# EasyEDA Pro project GD32F470IIH6.epro, schematic Schematic1
Create Date: 2024-01-08; Page Name: P1; Project Name: GD32_SDRAM_RGB888_20240421; Schematic Name: Schematic1; Update Date: 2024-04-21; Company: 嘉立创EDA; Page Size: A3; Version: V1.0
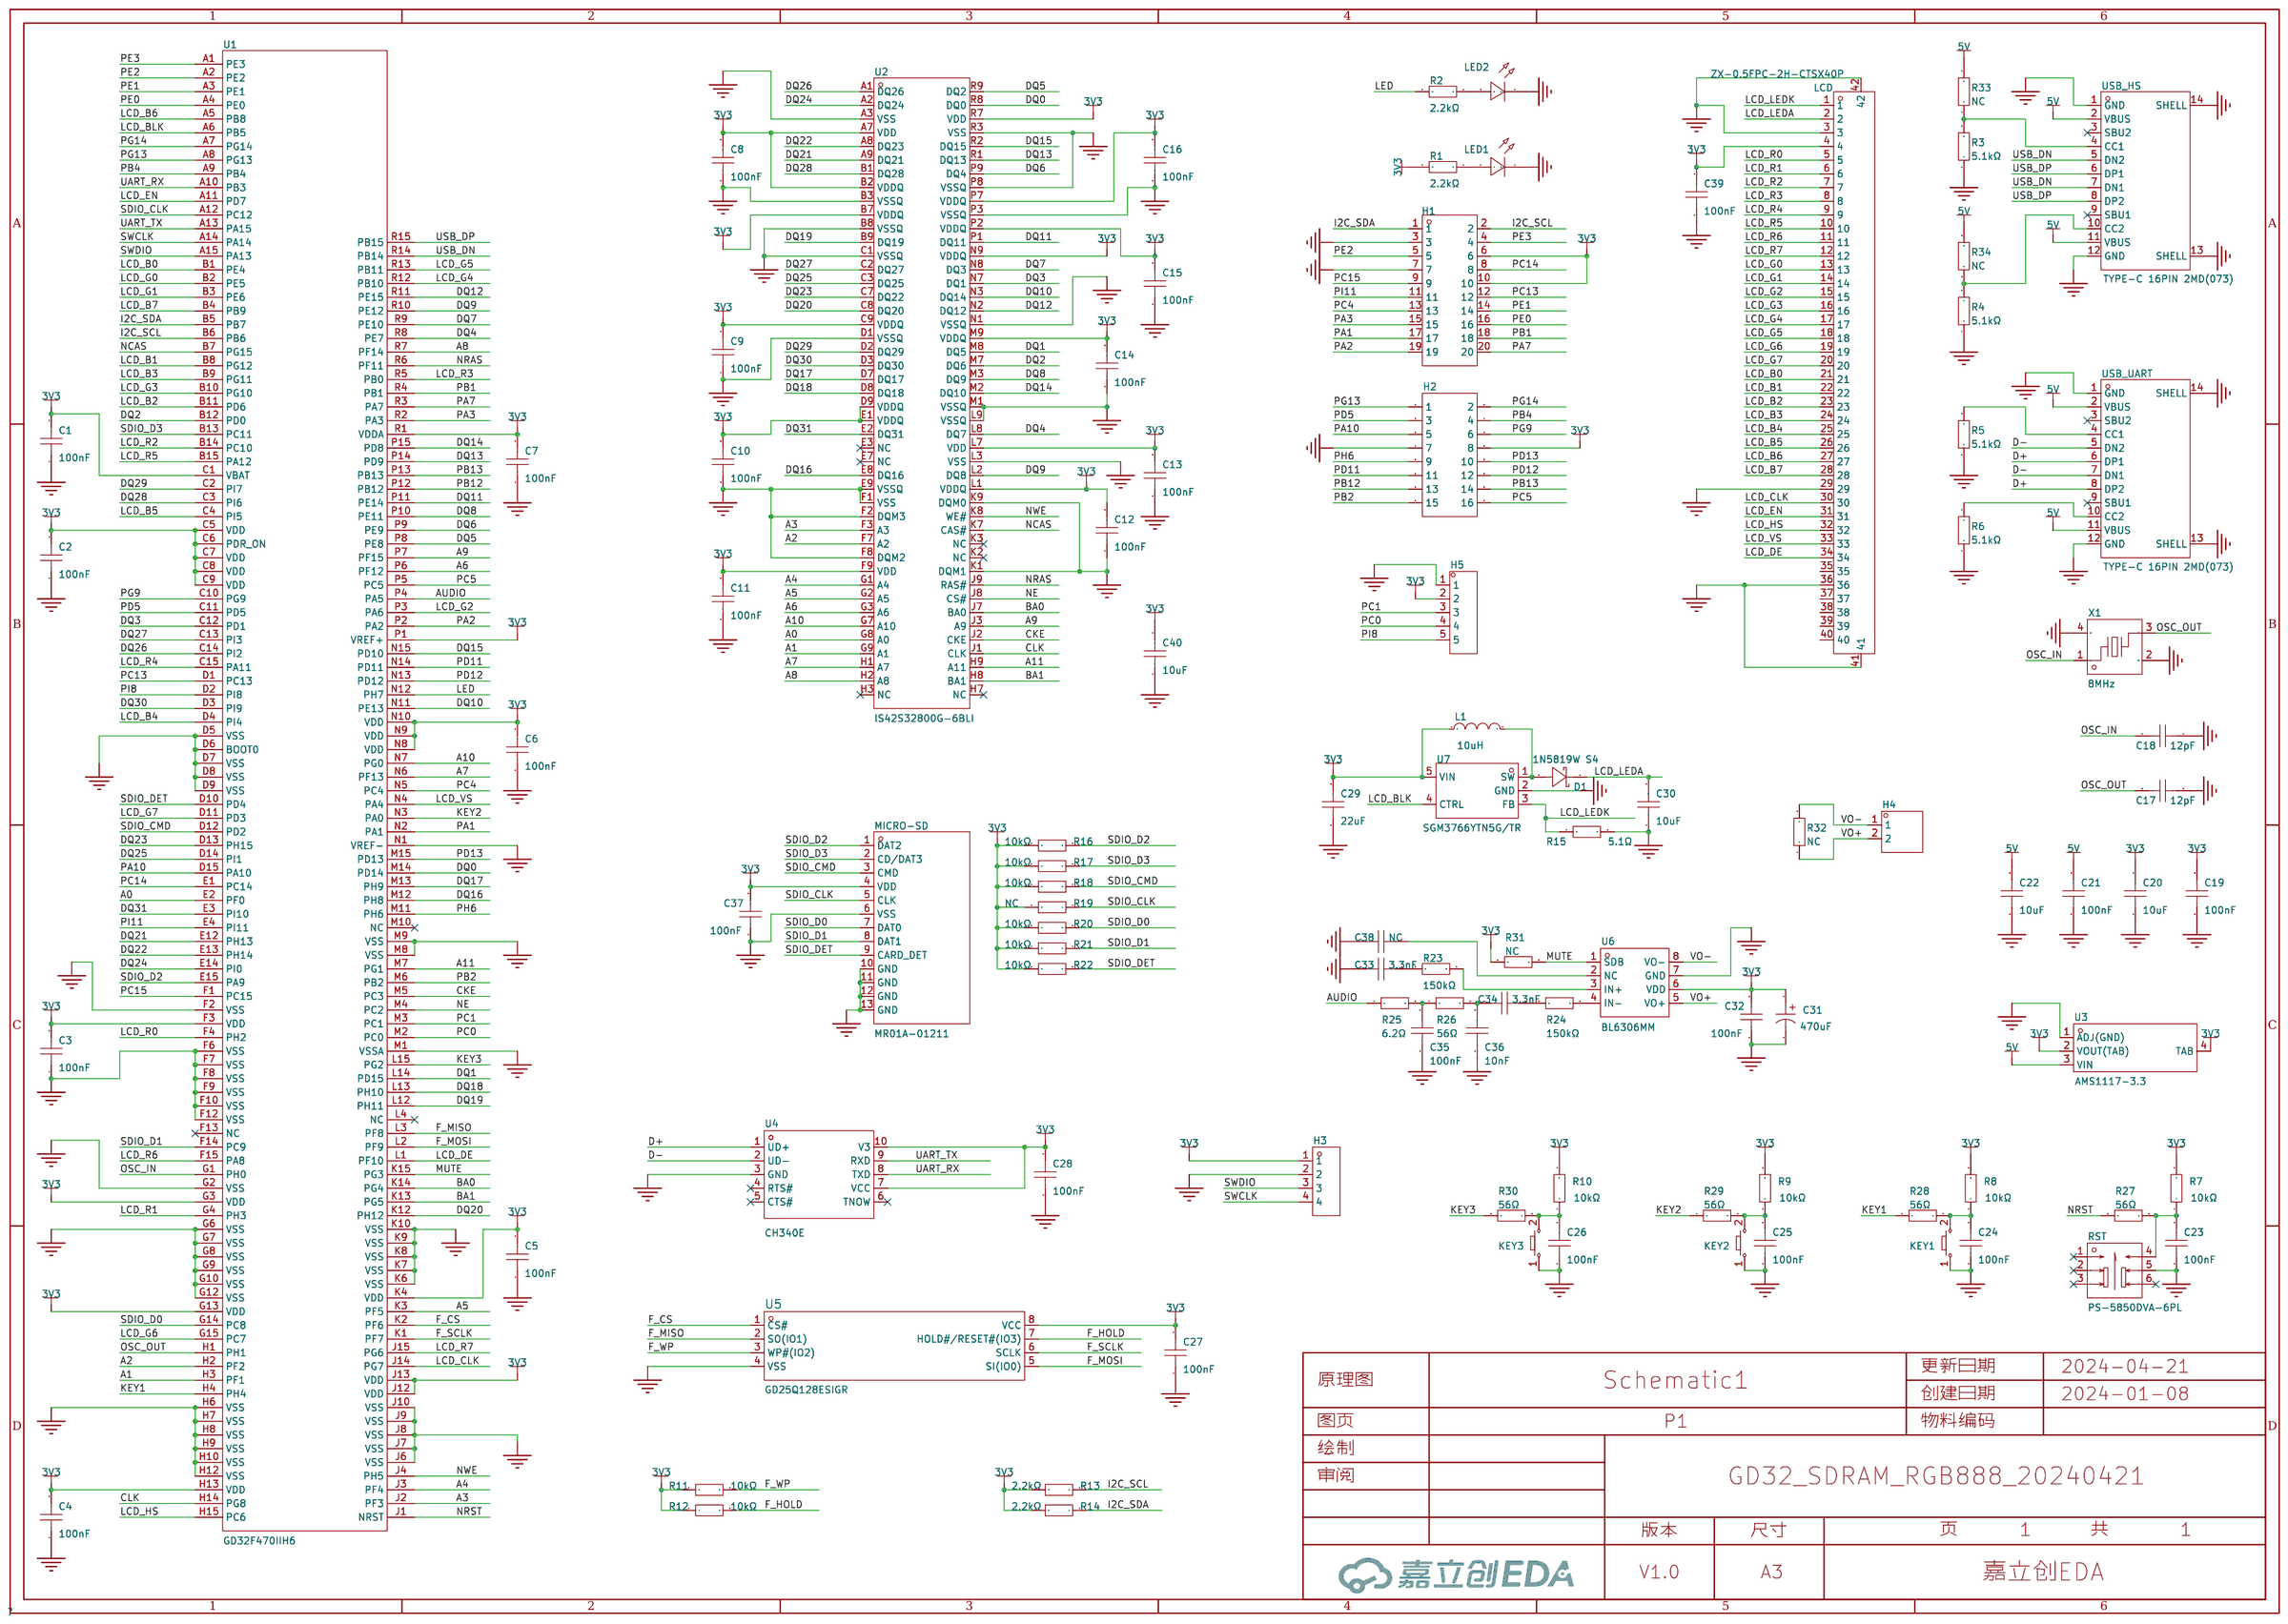
[diagram p0: schematic sheet]

## Parts
C1  100nF  [C0402]
C2  100nF  [C0402]
C3  100nF  [C0402]
C4  100nF  [C0402]
C5  100nF  [C0402]
C6  100nF  [C0402]
C7  100nF  [C0402]
C8  100nF  [C0402]
C9  100nF  [C0402]
C10  100nF  [C0402]
C11  100nF  [C0402]
C12  100nF  [C0402]
C13  100nF  [C0402]
C14  100nF  [C0402]
C15  100nF  [C0402]
C16  100nF  [C0402]
C17  12pF  [C0603]
C18  12pF  [C0603]
C19  100nF  [C0603]
C20  10uF  [C0805]
C21  100nF  [C0603]
C22  10uF  [C0805]
C23  100nF  [C0402]
C24  100nF  [C0402]
C25  100nF  [C0402]
C26  100nF  [C0402]
C27  100nF  [C0603]
C28  100nF  [C0603]
C29  22uF  [C0805]
C30  10uF  [C0805]
C31  470uF  [CAP-TH_BD6.3-P2.50-D0.5-FD]
C32  100nF  [C0603]
C33  3.3nF  [C0603]
C34  3.3nF  [C0603]
C35  100nF  [C0603]
C36  10nF  [C0603]
C37  100nF  [C0402]
C38  NC  [C0603]
C39  100nF  [C0402]
C40  10uF  [C0805]
D1  1N5819W S4  [SOD-123_L2.7-W1.6-LS3.7-FD]
H1  -  [HDR-TH_20P-P2.54-V-M-R2-C10-S2.54]
H2  -  [HDR-TH_16P-P2.54-V-M-R2-C8-S2.54]
H3  -  [HDR-TH_4P-P2.54-V-M]
H4  -  [HDR-TH_2P-P2.54-V-M-1]
H5  -  [HDR-TH_5P-P2.54-V-M]
KEY1  K2-1107ST-A4DW-06  [KEY-SMD_L6.2-W3.6-LS8.0]
KEY2  K2-1107ST-A4DW-06  [KEY-SMD_L6.2-W3.6-LS8.0]
KEY3  K2-1107ST-A4DW-06  [KEY-SMD_L6.2-W3.6-LS8.0]
L1  10uH  [IND-SMD_L4.0-W4.0]
LCD  ZX-0.5FPC-2H-CTSX40P  [FPC-SMD_40P-P0.50_ZX-0.5FPC-2H-CTSX40P]
LED1  XL-2012UGC  [LED0805-RD_GREEN]
LED2  XL-2012UGC  [LED0805-RD_GREEN]
MICRO-SD  MR01A-01211  [TF-SMD_MR01A-01211]
R1  2.2kΩ  [R0603]
R2  2.2kΩ  [R0603]
R3  5.1kΩ  [R0603]
R4  5.1kΩ  [R0603]
R5  5.1kΩ  [R0603]
R6  5.1kΩ  [R0603]
R7  10kΩ  [R0603]
R8  10kΩ  [R0603]
R9  10kΩ  [R0603]
R10  10kΩ  [R0603]
R11  10kΩ  [R0603]
R12  10kΩ  [R0603]
R13  2.2kΩ  [R0603]
R14  2.2kΩ  [R0603]
R15  5.1Ω  [R0603]
R16  10kΩ  [R0603]
R17  10kΩ  [R0603]
R18  10kΩ  [R0603]
R19  NC  [R0603]
R20  10kΩ  [R0603]
R21  10kΩ  [R0603]
R22  10kΩ  [R0603]
R23  150kΩ  [R0603]
R24  150kΩ  [R0603]
R25  6.2Ω  [R0603]
R26  56Ω  [R0603]
R27  56Ω  [R0603]
R28  56Ω  [R0603]
R29  56Ω  [R0603]
R30  56Ω  [R0603]
R31  NC  [R0603]
R32  NC  [R0603]
R33  NC  [R0603]
R34  NC  [R0603]
RST  PS-5850DVA-6PL  [SW-TH_6P-L5.8-W5.8-P2.00-LS4.5_PS-5850DVA-6PL]
U1  GD32F470IIH6  [BGA-201_L10.0-W10.0-P0.65-TL_GD32F450XXX]
U2  IS42S32800G-6BLI  [BGA-90_L13.0-W8.0-R6-C15-P0.80-TL]
U3  AMS1117-3.3  [SOT-223-4_L6.5-W3.5-P2.30-LS7.0-BR]
U4  CH340E  [MSOP-10_L3.0-W3.0-P0.50-LS5.0-BL]
U5  GD25Q128ESIGR  [SOP-8_L5.3-W5.3-P1.27-LS8.0-BL]
U6  BL6306MM  [MSOP-8_L3.0-W3.0-P0.65-LS4.9-BL]
U7  SGM3766YTN5G/TR  [TSOT-23-5_L2.9-W1.6-P0.95-LS2.8-BL]
USB_HS  TYPE-C 16PIN 2MD(073)  [USB-C-SMD_TYPE-C-6PIN-2MD-073]
USB_UART  TYPE-C 16PIN 2MD(073)  [USB-C-SMD_TYPE-C-6PIN-2MD-073]
X1  8MHz  [OSC-SMD_4P-L3.2-W2.5-BL]

## Library data of the parts
C1-C16 C23-C26 C37 C39 = CC0402KRX7R7BB104: 容值:100nF;精度:±10%;额定电压:16V;材质(温度系数):X7R;; LCSC Part Name: 100nF ±10% 16V; Supplier Part: C60474; Manufacturer: YAGEO(国巨); Supplier Footprint: 0402; JLCPCB Part Class: Extended Part; Datasheet: https://atta.szlcsc.com/upload/public/pdf/source/20211223/9278FD768280B81DDBEF48FA36411A03.pdf; Supplier: LCSC; Tolerance: ±10%; Voltage Rated: 16V; Temperature Coefficient: X7R; Check: true
C17 C18 = CL10C120JB8NNNC: 容值:12pF;精度:±5%;额定电压:50V;材质(温度系数):C0G;; LCSC Part Name: 12pF ±5% 50V; Supplier Part: C38523; Manufacturer: SAMSUNG(三星); Supplier Footprint: 0603; JLCPCB Part Class: Basic Part; Datasheet: https://atta.szlcsc.com/upload/public/pdf/source/20160218/1457707763339.pdf; Supplier: LCSC; Tolerance: ±5%; Voltage Rated: 50V; Temperature Coefficient: C0G; Check: true
C19 C21 C27 C28 C32 C35 = 0603B104K500NT: 容值:100nF;精度:±10%;额定电压:50V;材质(温度系数):X7R;; LCSC Part Name: 100nF ±10% 50V; Supplier Part: C30926; Manufacturer: FH(风华); Supplier Footprint: 0603; JLCPCB Part Class: Extended Part; Datasheet: https://atta.szlcsc.com/upload/public/pdf/source/20200305/C486355_26A10D38EF8C2A5C37091D0039909270.pdf; Supplier: LCSC; Tolerance: ±10%; Voltage Rated: 50V; Temperature Coefficient: X7R; Check: true
C20 C22 C30 C40 = CL21A106KAYNNNE_C15850: 容值:10uF;精度:±10%;额定电压:25V;材质(温度系数):X5R;; LCSC Part Name: 10uF ±10% 25V; Supplier Part: C15850; Manufacturer: SAMSUNG(三星); Manufacturer Part: CL21A106KAYNNNE; Supplier Footprint: 0805; JLCPCB Part Class: Basic Part; Datasheet: https://atta.szlcsc.com/upload/public/pdf/source/20160218/1457707763339.pdf; Supplier: LCSC; Tolerance: ±10%; Voltage Rated: 25V; Temperature Coefficient: X5R; Check: true
C29 = CL21A226MAQNNNE: 容值:22uF;精度:±20%;额定电压:25V;材质(温度系数):X5R;; LCSC Part Name: 22uF ±20% 25V; Supplier Part: C45783; Manufacturer: SAMSUNG(三星); Supplier Footprint: 0805; JLCPCB Part Class: Basic Part; Datasheet: https://atta.szlcsc.com/upload/public/pdf/source/20160218/1457707763339.pdf; Supplier: LCSC; Tolerance: ±20%; Voltage Rated: 25V; Temperature Coefficient: X5R; Check: true
C31 = GR1C471M0611: 容值:470uF;精度:±20%;额定电压:16V;纹波电流:-;等效串联电阻:-;; LCSC Part Name: 470uF ±20% 16V; Supplier Part: C2873966; Manufacturer: ROQANG(容强); Supplier Footprint: 插件,D6.3xL11mm; JLCPCB Part Class: 扩展库; Datasheet: https://atta.szlcsc.com/upload/public/pdf/source/20220308/D48251384B7F3C8BC717F16A50EC19EF.pdf; Supplier: LCSC; Tolerance: ±20%; Rated Voltage: 16V; φD: 6.3mm; L: 11mm; Check: true
C33 C34 = CL10B332KB8NNNC: 容值:3.3nF;精度:±10%;额定电压:50V;材质(温度系数):X7R;; LCSC Part Name: 3.3nF ±10% 50V; Supplier Part: C1613; Manufacturer: SAMSUNG(三星); Supplier Footprint: 0603; JLCPCB Part Class: Basic Part; Datasheet: https://atta.szlcsc.com/upload/public/pdf/source/20160218/1457707763339.pdf; Supplier: LCSC; Tolerance: ±10%; Voltage Rated: 50V; Temperature Coefficient: X7R; Check: true
C36 = 0603B103K500NT: 容值:10nF;精度:±10%;额定电压:50V;材质(温度系数):X7R;; LCSC Part Name: 10nF ±10% 50V; Supplier Part: C57112; Manufacturer: FH(风华); Supplier Footprint: 0603; JLCPCB Part Class: Basic Part; Datasheet: https://atta.szlcsc.com/upload/public/pdf/source/20200305/C486355_26A10D38EF8C2A5C37091D0039909270.pdf; Supplier: LCSC; Tolerance: ±10%; Voltage Rated: 50V; Temperature Coefficient: X7R; Check: true
C38 = CAP_0603: Supplier Footprint: 0603; Check: true
D1 = 1N5819W S4: 二极管配置:-;正向压降(Vf):600mV@200mA;直流反向耐压(Vr):40V;平均整流电流(Io):350mA;; LCSC Part Name: 电压:40V 电流:350mA; Supplier Part: C2939006; Manufacturer: KUU; Supplier Footprint: SOD-123; JLCPCB Part Class: 扩展库; Datasheet: https://atta.szlcsc.com/upload/public/pdf/source/20220104/054CAEE816AAE12211B33E667335376D.pdf; Supplier: LCSC; Forward Voltage (Vf@If): 600mV@200mA; Reverse Voltage (Vr): 40V; Average Rectified Current (Io): 350mA; Reverse Leakage Current (Ir): 5uA@30V; Check: true
H1 = HDR-M_2.54_2x10: Supplier Part: C30734; Supplier Footprint: 插件,P=2.54mm; Check: true
H2 = HDR-M_2.54_2x8: Supplier Part: C68234; Supplier Footprint: 插件,P=2.54mm; Check: true
H3 = HDR-M_2.54_1x4P: Supplier Part: C492403; Supplier Footprint: 插件; Check: true
H4 = HDR-M_2.54_1x2P: Supplier Part: C124375; Supplier Footprint: 插件; Check: true
H5 = HDR-M_2.54_1x5P: Supplier Part: C358687; Supplier Footprint: 插件
KEY1-KEY3 = K2-1107ST-A4DW-06: 电路结构:单刀单掷;按钮形状:矩形按钮;作用力:250gf;安装方式:立贴;开关长度:6.1mm;开关宽度:3.6mm;开关高度:2.5mm;触点电流:50mA;额定电压(DC):12V;绝缘电阻:100MΩ;带灯:-;机械寿命:10万次;; LCSC Part Name: 轻触开关 3.6*6.1*2.5; Supplier Part: C118141; Manufacturer: 韩国韩荣; Supplier Footprint: SMD; JLCPCB Part Class: Extended Part; Datasheet: https://atta.szlcsc.com/upload/public/pdf/source/20210810/381712CEF248770C072B585C3485C888.pdf; Supplier: LCSC; Circuit: 单刀单掷; Actuator Style: 矩形按钮; Operating Force: 250gf; Mounting Style: 立贴; Switch Length: 6.1mm; Switch Width: 3.6mm; Switch Height: 2.5mm; Contact Current: 50mA; Voltage Rating (DC): 12V; Insulation Resistance: 100MΩ; Mechanical Life: 10万次; Operating Temperature: -25℃~+85℃; Check: true
L1 = FHD4020S-100MT: 电感值:10uH;精度:±20%;额定电流:2.35A;饱和电流(Isat):3.5A;; LCSC Part Name: 10uH ±20% 3.5A; Supplier Part: C602032; Manufacturer: cjiang(长江微电); Supplier Footprint: SMD,4x4mm; JLCPCB Part Class: 扩展库; Datasheet: https://atta.szlcsc.com/upload/public/pdf/source/20200609/C601990_BCEA243EC4DA0A9A288AA78A6DFB48A5.pdf; Supplier: LCSC; Tolerance: ±20%; Rated Current: 2.35A; Saturation Current (Isat): 3.5A; DC Resistance (DCR): 190mΩ
LCD = ZX-0.5FPC-2H-CTSX40P: 锁定特性:抽屉式;触点类型:上接;触点数量:40P;间距:0.5mm;安装类型:卧贴;工作温度范围:-25℃~+85℃;焊接温度(最大值):260℃;; LCSC Part Name: 间距:0.5mm P数:40P 抽屉式 上接; Supplier Part: C19191165; Manufacturer: Megastar(兆星); Supplier Footprint: SMD,P=0.5mm,卧贴; Datasheet: https://atta.szlcsc.com/upload/public/pdf/source/20231122/E6131C7FE9DD3C65191621EC56048569.pdf; Supplier: LCSC; Locking Feature: 抽屉式; Contact Type: 上接; Number of Contacts: 40P; Pitch: 0.5mm; Mounting Type: 卧贴; FFC, FCB Thickness: 0.3mm; Height Above Board: 2mm; Contact Material: 铜合金; Contact Plating: 锡; Operating Temperature Range: -25℃~+85℃; Soldering Temperature(Max): 260℃
LED1 LED2 = XL-2012UGC: 发光颜色:翠绿色;功率:80mW;正向电流:25mA;主波长:516nm~525nm;透镜颜色:无色透明透镜;色温:-;发光角度:120°;载带方式:正贴;工作温度:-30℃~+85℃;; Supplier Part: C965815; Manufacturer: XINGLIGHT(成兴光); Supplier Footprint: 0805; JLCPCB Part Class: Extended Part; Datasheet: https://atta.szlcsc.com/upload/public/pdf/source/20221102/ACA6CBC413A1A8AF38BEBA54306464BE.pdf; Supplier: LCSC; Emitted Color: 翠绿色; Power Dissipation: 80mW; Forward Current: 25mA; Dominant Wavelength: 516nm~525nm; Peak Wavelength: 534nm; Lens Color: 无色透明透镜; Viewing Angle: 120°; Mounting Sytle: 正贴; Operating Temperature: -30℃~+85℃; Forward Voltage (VF): 2.5V~3.6V; Luminous Intensity: 180mcd~400mcd; Check: true
MICRO-SD = MR01A-01211: 卡类型:MicroSD卡(TF卡);连接器类型:卡座;卡连接方式:自弹式;本体最大高度:1.85mm;工作温度范围:-25℃~+85℃;; Supplier Part: C479742; Manufacturer: ATOM(爱特姆); Supplier Footprint: SMD; JLCPCB Part Class: 扩展库; Datasheet: https://atta.szlcsc.com/upload/public/pdf/source/20200107/C479742_0284EDD146B0D8F7A9D47B481AEA01A2.pdf; Supplier: LCSC; Card Type: MicroSD卡(TF卡); Connector Type: 卡座; Card Connection Mode: 自弹式; Maximum Body Height: 1.85mm; Operating Temperature Range: -25℃~+85℃; Check: true
R1 R2 R13 R14 = 0603WAF2201T5E: 电阻类型:厚膜电阻;阻值:2.2kΩ;精度:±1%;功率:100mW;最大工作电压:75V;温度系数:±100ppm/℃;; LCSC Part Name: 2.2kΩ ±1% 100mW 厚膜电阻; Supplier Part: C4190; Manufacturer: UNI-ROYAL(厚声); Supplier Footprint: 0603; JLCPCB Part Class: Basic Part; Datasheet: https://atta.szlcsc.com/upload/public/pdf/source/20200306/C422600_1E6D84923E4A46A82E41ADD87F860B5C.pdf; Supplier: LCSC; Type: 厚膜电阻; Tolerance: ±1%; Power(Watts): 100mW; Overload Voltage (Max): 75V; Temperature Coefficient: ±100ppm/℃; Operating Temperature Range: -55℃~+155℃; Check: true
R3-R6 R33 R34 = 0603WAF5101T5E: 电阻类型:厚膜电阻;阻值:5.1kΩ;精度:±1%;功率:100mW;最大工作电压:75V;温度系数:±100ppm/℃;; LCSC Part Name: 5.1kΩ ±1% 100mW 厚膜电阻; Supplier Part: C23186; Manufacturer: UNI-ROYAL(厚声); Supplier Footprint: 0603; JLCPCB Part Class: Basic Part; Datasheet: https://atta.szlcsc.com/upload/public/pdf/source/20200306/C422600_1E6D84923E4A46A82E41ADD87F860B5C.pdf; Supplier: LCSC; Type: 厚膜电阻; Tolerance: ±1%; Power(Watts): 100mW; Overload Voltage (Max): 75V; Temperature Coefficient: ±100ppm/℃; Operating Temperature Range: -55℃~+155℃; Check: true
R7-R12 R16-R22 R31 = 0603WAF1002T5E: 电阻类型:厚膜电阻;阻值:10kΩ;精度:±1%;功率:100mW;最大工作电压:75V;温度系数:±100ppm/℃;; LCSC Part Name: 厚膜电阻 10kΩ ±1% 100mW; Supplier Part: C25804; Manufacturer: UNI-ROYAL(厚声); Supplier Footprint: 0603; JLCPCB Part Class: Basic Part; Datasheet: https://atta.szlcsc.com/upload/public/pdf/source/20200306/C422600_1E6D84923E4A46A82E41ADD87F860B5C.pdf; Supplier: LCSC; Type: 厚膜电阻; Tolerance: ±1%; Power(Watts): 100mW; Overload Voltage (Max): 75V; Temperature Coefficient: ±100ppm/℃; Operating Temperature Range: -55℃~+155℃; Check: true
R15 = 0603WAJ051JT5E: 电阻类型:厚膜电阻;阻值:5.1Ω;精度:±5%;功率:100mW;最大工作电压:75V;温度系数:±400ppm/℃;; LCSC Part Name: 5.1Ω ±5% 100mW 厚膜电阻; Supplier Part: C25249; Manufacturer: UNI-ROYAL(厚声); Supplier Footprint: 0603; JLCPCB Part Class: 扩展库; Datasheet: https://atta.szlcsc.com/upload/public/pdf/source/20200306/C422600_1E6D84923E4A46A82E41ADD87F860B5C.pdf; Supplier: LCSC; Type: 厚膜电阻; Tolerance: ±5%; Power(Watts): 100mW; Overload Voltage (Max): 75V; Temperature Coefficient: ±400ppm/℃; Operating Temperature Range: -55℃~+155℃
R23 R24 = 0603WAF1503T5E: 电阻类型:厚膜电阻;阻值:150kΩ;精度:±1%;功率:100mW;最大工作电压:75V;温度系数:±100ppm/℃;; LCSC Part Name: 150kΩ ±1% 100mW 厚膜电阻; Supplier Part: C22807; Manufacturer: UNI-ROYAL(厚声); Supplier Footprint: 0603; JLCPCB Part Class: Basic Part; Datasheet: https://atta.szlcsc.com/upload/public/pdf/source/20200306/C422600_1E6D84923E4A46A82E41ADD87F860B5C.pdf; Supplier: LCSC; Type: 厚膜电阻; Tolerance: ±1%; Power(Watts): 100mW; Overload Voltage (Max): 75V; Temperature Coefficient: ±100ppm/℃; Operating Temperature Range: -55℃~+155℃; Check: true
R25 R32 = 0603WAJ062JT5E: 阻值:6.2Ω;精度:±5%;功率:100mW;温度系数:±200ppm/℃;电阻类型:厚膜电阻;; LCSC Part Name: 6.2Ω ±5% 100mW 厚膜电阻; Supplier Part: C25255; Manufacturer: UNI-ROYAL(厚声); Supplier Footprint: 0603; JLCPCB Part Class: 扩展库; Datasheet: https://atta.szlcsc.com/upload/public/pdf/source/20200306/C422600_1E6D84923E4A46A82E41ADD87F860B5C.pdf; Supplier: LCSC; Tolerance: ±5%; Power(Watts): 100mW; Overload Voltage (Max): 75V; Temperature Coefficient: ±200ppm/℃; Type: 厚膜电阻; Operating Temperature Range: -55℃~+155℃; Check: true
R26-R30 = 0603WAF560JT5E: 电阻类型:厚膜电阻;阻值:56Ω;精度:±1%;功率:100mW;最大工作电压:75V;温度系数:±200ppm/℃;; LCSC Part Name: 56Ω ±1% 100mW 厚膜电阻; Supplier Part: C25196; Manufacturer: UNI-ROYAL(厚声); Supplier Footprint: 0603; JLCPCB Part Class: 扩展库; Datasheet: https://atta.szlcsc.com/upload/public/pdf/source/20200306/C422600_1E6D84923E4A46A82E41ADD87F860B5C.pdf; Supplier: LCSC; Type: 厚膜电阻; Tolerance: ±1%; Power(Watts): 100mW; Overload Voltage (Max): 75V; Temperature Coefficient: ±200ppm/℃; Operating Temperature Range: -55℃~+155℃; Check: true
RST = PS-5850DVA-6PL: LCSC Part Name: 5.85.8六脚插板按键开关 自锁 160gf 3万寿命; Supplier Part: C5362621; Manufacturer: G-Switch(品赞); Datasheet: https://atta.szlcsc.com/upload/public/pdf/source/20230301/33AFE68FFBCC8FFE949B966EE62B2D52.pdf; Supplier: LCSC; Check: true
U1 = GD32F450IKH6: CPU内核:CM4;程序存储容量:512KB;RAM总容量:256KB;GPIO端口数量:140;工作电压范围:2.6V~3.6V;CPU最大主频:200MHz;程序存储器类型:FLASH;; Supplier Part: C2835082; Manufacturer: GigaDevice(兆易创新); Supplier Footprint: BGA-176; JLCPCB Part Class: 扩展库; Datasheet: https://atta.szlcsc.com/upload/public/pdf/source/20210608/C2835082_1B0108F20CB7F4615A6A76D6F1814B58.pdf; Supplier: LCSC; CPU Core: CM4; Program Storage Size: 512KB; RAM Size: 256KB; GPIO Ports Number: 140; Operating Voltage Range: 2.6V~3.6V; CPU Maximum Speed: 200MHz; Program Memory Type: FLASH; Operating Temperature Range: -40℃~+85℃; ADC (Bit): 12bit; DAC (Bit): 12bit; PWM (Bit): 16bit; 16Bit Timer: 10; 32Bit Timer: 2; CAN: 2; UART/USART: 8; I2C: 3; SPI: 5; Universal Serial Bus: 有; Peripheral/Function: 片载温度传感器；DMA；看门狗；LIN总线协议；PWM；LCD/LED驱动；以太网协议栈；IrDA；SDIO；RTC实时时钟; communication protocol: 以太网协议; Watchdog: 有; Real-Time Clock: 有; Infrared Data Association: 有; Secure Digital Input and Output: 有; Direct Memory Access: 有; Internal Oscillator: 有; Check: true
U2 = IS42S32800J-7BL: 存储器类型:-;存储器容量:-;存储器接口类型:-;工作电压:-;; LCSC Part Name: IS42S32800J 7BL; Supplier Part: C1349284; Manufacturer: ISSI(美国芯成); Supplier Footprint: TFBGA-90(8x13); JLCPCB Part Class: 扩展库; Datasheet: https://atta.szlcsc.com/upload/public/pdf/source/20210202/C1349284_CA3CEC5602E4679D049D183769B21E3F.pdf; Supplier: LCSC; Check: true
U3 = AMS1117-3.3_C347222: 输出类型:固定;最大输入电压:18V;输出电压:3.3V;输出电流:1A;电源纹波抑制比(PSRR):60dB@(120Hz);输出极性:正;; LCSC Part Name: 输入18V 输出3.3V 1A; Supplier Part: C347222; Manufacturer: UMW(友台半导体); Supplier Footprint: SOT-223; JLCPCB Part Class: 扩展库; Datasheet: https://atta.szlcsc.com/upload/public/pdf/source/20231109/155D79A26D9DB04352555A58D5969DC8.pdf; Supplier: LCSC; Output Type: 固定; Maximum Input Voltage: 18V; Output Voltage: 3.3V; Output Current: 1A; Power Supply Rejection Ratio (PSRR): 60dB@(120Hz); Dropout Voltage: 1.3V@(1A); Output Polarity: 正; Number of Outputs: 1; Check: true
U4 = CH340E: 应用功能:收发器;接口协议:USB 2.0;数据速率:2Mbps;; LCSC Part Name: USB转串口芯片 CH340; Supplier Part: C99652; Manufacturer: WCH(南京沁恒); Supplier Footprint: MSOP-10; JLCPCB Part Class: 扩展库; Datasheet: https://atta.szlcsc.com/upload/public/pdf/source/20230530/6E401E9554E9F5311886CC8B3F89B62E.pdf; Supplier: LCSC; Applications Function: 收发器; Protocol: USB 2.0; Data Rate: 2Mbps; Supply Voltage: 3.3V；5V; Check: true
U5 = GD25Q128ESIGR: 接口类型:SPI;存储容量:128Mbit;时钟频率(fc):133MHz;; Supplier Part: C2928891; Manufacturer: GigaDevice(兆易创新); Supplier Footprint: SOP-8-208mil; JLCPCB Part Class: 扩展库; Datasheet: https://atta.szlcsc.com/upload/public/pdf/source/20210423/C2758105_5B8FF46BBA9FF880A5F3E50B6815040C.pdf; Supplier: LCSC; Interface Type: SPI; Memory Size: 128Mbit; Clock Frequency (fc): 133MHz; Supply Voltage: 2.7V~3.6V; Operating Temperature: -40℃~+85℃; Check: true
U6 = BL6306MM: 功放类型:-;输出功率:-;; Supplier Part: C692272; Manufacturer: BL(上海贝岭); Supplier Footprint: MSOP-8; JLCPCB Part Class: 扩展库; Datasheet: https://atta.szlcsc.com/upload/public/pdf/source/20200628/C692272_F018E47F8449AF4A691BD8FD56389EFF.pdf; Supplier: LCSC; Check: true
U7 = SGM3766YTN5G/TR: Supplier Part: C5153481; Manufacturer: SGMICRO(圣邦微); Supplier Footprint: TSOT-23-5; JLCPCB Part Class: 扩展库; Datasheet: https://atta.szlcsc.com/upload/public/pdf/source/20221012/442720F1A2DB2C689412A6BDE8CAE1E9.pdf; Supplier: LCSC; Check: true
USB_HS USB_UART = TYPE-C 16PIN 2MD(073): 连接器类型:Type-C;标准:-;公母:母;端口数量:1;触点数量:16P;安装方式:卧贴;额定电流 - 电源:5A;工作温度范围:-25℃~+85℃;; LCSC Part Name: Type-C 母 卧贴 带定位柱 不锈钢外壳 2次模顶; Supplier Part: C2765186; Manufacturer: SHOU HAN(首韩); Supplier Footprint: SMD; JLCPCB Part Class: 扩展库; Datasheet: https://atta.szlcsc.com/upload/public/pdf/source/20211123/39B17C16241EAC15C5E277BDA434118E.pdf; Supplier: LCSC; Connector Type: Type-C; Gender: 母; Number of Ports: 1; Number of Contacts: 16P; Mounting Style: 卧贴; Current Rating - Power (Max): 5A; Operating Temperature Range: -25℃~+85℃; Check: true
X1 = X32258MOB4SI: 晶振类型:贴片晶振;频率:8MHz;常温频差:±10ppm;外接负载电容:12pF;频率稳定度(全温):±30ppm;; LCSC Part Name: 8MHz ±10ppm 12pF; Supplier Part: C2682775; Manufacturer: YXC(扬兴晶振); Supplier Footprint: SMD3225-4P; JLCPCB Part Class: 扩展库; Datasheet: https://atta.szlcsc.com/upload/public/pdf/source/20210106/C2682774_0CD4FDA5D9DA3FBEEC23BD607A48E4B0.pdf; Supplier: LCSC; Crystal Type: 贴片晶振; Normal temperature Frequency Tolerance: ±10ppm; External load capacitor: 12pF; Frequency Stability(Full temperature range): ±30ppm; Equivalent Series Resistance (ESR): 150Ω; Operating Temperature: -40℃~+85℃; Check: true

## Nets
3V3: C1.2 C2.2 C3.2 C4.2 C5.2 C6.2 C7.2 C8.2 C9.2 C10.2 C11.2 C12.2 C13.2 C14.2 C15.2 C16.2 C19.2 C20.2 C27.2 C28.2 C29.2 C31.1 C32.2 C37.2 C39.2 C40.2 H1.6 H1.10 H2.8 H3.1 H5.2 L1.1 LCD.4 MICRO-SD.4(VDD) R1.2 R7.2 R8.2 R9.2 R10.2 R11.1 R12.1 R13.2 R14.2 R16.2 R17.2 R18.2 R19.2 R20.2 R21.2 R22.2 R31.1 U1.C1(VBAT) U1.C5(VDD) U1.C6(PDR_ON) U1.C7(VDD) U1.C8(VDD) U1.C9(VDD) U1.F3(VDD) U1.G3(VDD) U1.G13(VDD) U1.H13(VDD) U1.J12(VDD) U1.J13(VDD) U1.K4(VDD) U1.N8(VDD) U1.N9(VDD) U1.N10(VDD) U1.P1(VREF+) U1.R1(VDDA) U2.A7(VDD) U2.B2(VDDQ) U2.B7(VDDQ) U2.C9(VDDQ) U2.D9(VDDQ) U2.E1(VDDQ) U2.F9(VDD) U2.L1(VDDQ) U2.L7(VDD) U2.M9(VDDQ) U2.N9(VDDQ) U2.P2(VDDQ) U2.P7(VDDQ) U2.R7(VDD) U3.2(VOUT(TAB)) U3.4(TAB) U4.7(VCC) U4.10(V3) U5.8(VCC) U6.6(VDD) U7.5(VIN)
5V: C21.2 C22.2 R33.2 R34.2 U3.3(VIN) USB_HS.2(VBUS) USB_HS.11(VBUS) USB_UART.2(VBUS) USB_UART.11(VBUS)
GND: C1.1 C2.1 C3.1 C4.1 C5.1 C6.1 C7.1 C8.1 C9.1 C10.1 C11.1 C12.1 C13.1 C14.1 C15.1 C16.1 C17.2 C18.2 C19.1 C20.1 C21.1 C22.1 C23.1 C24.1 C25.1 C26.1 C27.1 C28.1 C29.1 C30.1 C31.2 C32.1 C33.1 C35.1 C36.1 C37.1 C38.2 C39.1 C40.1 H1.3 H1.7 H2.7 H3.2 H5.1 KEY1.1 KEY2.1 KEY3.1 LCD.3 LCD.29 LCD.36 LCD.41 LCD.42 LED1.1(C) LED2.1(C) MICRO-SD.6(VSS) MICRO-SD.10(GND) MICRO-SD.11(GND) MICRO-SD.12(GND) MICRO-SD.13(GND) R3.1 R4.1 R5.1 R6.1 R15.2 RST.5 U1.D5(VSS) U1.D6(BOOT0) U1.D7(VSS) U1.D8(VSS) U1.D9(VSS) U1.F2(VSS) U1.F6(VSS) U1.F7(VSS) U1.F8(VSS) U1.F9(VSS) U1.F10(VSS) U1.F12(VSS) U1.G2(VSS) U1.G6(VSS) U1.G7(VSS) U1.G8(VSS) U1.G9(VSS) U1.G10(VSS) U1.G12(VSS) U1.H6(VSS) U1.H7(VSS) U1.H8(VSS) U1.H9(VSS) U1.H10(VSS) U1.H12(VSS) U1.J6(VSS) U1.J7(VSS) U1.J8(VSS) U1.J9(VSS) U1.J10(VSS) U1.K6(VSS) U1.K7(VSS) U1.K8(VSS) U1.K9(VSS) U1.K10(VSS) U1.M1(VSSA) U1.M8(VSS) U1.M9(VSS) U1.N1(VREF-) U2.A3(VSS) U2.B3(VSSQ) U2.B8(VSSQ) U2.C1(VSSQ) U2.D1(VSSQ) U2.E9(VSSQ) U2.F1(VSS) U2.F2(DQM3) U2.F8(DQM2) U2.K1(DQM1) U2.K9(DQM0) U2.L3(VSS) U2.L9(VSSQ) U2.M1(VSSQ) U2.N1(VSSQ) U2.P3(VSSQ) U2.P8(VSSQ) U2.R3(VSS) U3.1(ADJ(GND)) U4.3(GND) U5.4(VSS) U6.7(GND) U7.2(GND) USB_HS.1(GND) USB_HS.12(GND) USB_HS.13(SHELL) USB_HS.14(SHELL) USB_UART.1(GND) USB_UART.12(GND) USB_UART.13(SHELL) USB_UART.14(SHELL) X1.2(GND) X1.4(GND)
A0: U1.E2(PF0) U2.G8(A0)
A1: U1.H3(PF1) U2.G9(A1)
A2: U1.H2(PF2) U2.F7(A2)
A3: U1.J2(PF3) U2.F3(A3)
A4: U1.J3(PF4) U2.G1(A4)
A5: U1.K3(PF5) U2.G2(A5)
A6: U1.P6(PF12) U2.G3(A6)
A7: U1.N6(PF13) U2.H1(A7)
A8: U1.R7(PF14) U2.H2(A8)
A9: U1.P7(PF15) U2.J3(A9)
A10: U1.N7(PG0) U2.G7(A10)
A11: U1.M7(PG1) U2.H9(A11)
AUDIO: R25.1 U1.P4(PA5)
BA0: U1.K14(PG4) U2.J7(BA0)
BA1: U1.K13(PG5) U2.H8(BA1)
CKE: U1.M5(PC3) U2.J2(CKE)
CLK: U1.H14(PG8) U2.J1(CLK)
D+: U4.1(UD+) USB_UART.6(DP1) USB_UART.8(DP2)
D-: U4.2(UD-) USB_UART.5(DN2) USB_UART.7(DN1)
DQ0: U1.M14(PD14) U2.R8(DQ0)
DQ1: U1.L14(PD15) U2.M8(DQ5)
DQ2: U1.B12(PD0) U2.M7(DQ6)
DQ3: U1.C12(PD1) U2.N7(DQ1)
DQ4: U1.R8(PE7) U2.L8(DQ7)
DQ5: U1.P8(PE8) U2.R9(DQ2)
DQ6: U1.P9(PE9) U2.P9(DQ4)
DQ7: U1.R9(PE10) U2.N8(DQ3)
DQ8: U1.P10(PE11) U2.M3(DQ9)
DQ9: U1.R10(PE12) U2.L2(DQ8)
DQ10: U1.N11(PE13) U2.N3(DQ14)
DQ11: U1.P11(PE14) U2.P1(DQ11)
DQ12: U1.R11(PE15) U2.N2(DQ12)
DQ13: U1.P14(PD9) U2.R1(DQ13)
DQ14: U1.P15(PD8) U2.M2(DQ10)
DQ15: U1.N15(PD10) U2.R2(DQ15)
DQ16: U1.M12(PH8) U2.E8(DQ16)
DQ17: U1.M13(PH9) U2.D7(DQ17)
DQ18: U1.L13(PH10) U2.D8(DQ18)
DQ19: U1.L12(PH11) U2.B9(DQ19)
DQ20: U1.K12(PH12) U2.C8(DQ20)
DQ21: U1.E12(PH13) U2.A9(DQ21)
DQ22: U1.E13(PH14) U2.A8(DQ23)
DQ23: U1.D13(PH15) U2.C7(DQ22)
DQ24: U1.E14(PI0) U2.A2(DQ24)
DQ25: U1.D14(PI1) U2.C3(DQ25)
DQ26: U1.C14(PI2) U2.A1(DQ26)
DQ27: U1.C13(PI3) U2.C2(DQ27)
DQ28: U1.C3(PI6) U2.B1(DQ28)
DQ29: U1.C2(PI7) U2.D2(DQ29)
DQ30: U1.D3(PI9) U2.D3(DQ30)
DQ31: U1.E3(PI10) U2.E2(DQ31)
F_CS: U1.K2(PF6) U5.1(CS#)
F_HOLD: R12.2 U5.7(HOLD#/RESET#(IO3))
F_MISO: U1.L3(PF8) U5.2(SO(IO1))
F_MOSI: U1.L2(PF9) U5.5(SI(IO0))
F_SCLK: U1.K1(PF7) U5.6(SCLK)
F_WP: R11.2 U5.3(WP#(IO2))
I2C_SCL: H1.2 R13.1 U1.B6(PB6)
I2C_SDA: H1.1 R14.1 U1.B5(PB7)
KEY1: R28.1 U1.H4(PH4)
KEY2: R29.1 U1.N3(PA0)
KEY3: R30.1 U1.L15(PG2)
LCD_B0: LCD.21 U1.B1(PE4)
LCD_B1: LCD.22 U1.B8(PG12)
LCD_B2: LCD.23 U1.B11(PD6)
LCD_B3: LCD.24 U1.B9(PG11)
LCD_B4: LCD.25 U1.D4(PI4)
LCD_B5: LCD.26 U1.C4(PI5)
LCD_B6: LCD.27 U1.A5(PB8)
LCD_B7: LCD.28 U1.B4(PB9)
LCD_BLK: U1.A6(PB5) U7.4(CTRL)
LCD_CLK: LCD.30 U1.J14(PG7)
LCD_DE: LCD.34 U1.L1(PF10)
LCD_EN: LCD.31 U1.A11(PD7)
LCD_G0: LCD.13 U1.B2(PE5)
LCD_G1: LCD.14 U1.B3(PE6)
LCD_G2: LCD.15 U1.P3(PA6)
LCD_G3: LCD.16 U1.B10(PG10)
LCD_G4: LCD.17 U1.R12(PB10)
LCD_G5: LCD.18 U1.R13(PB11)
LCD_G6: LCD.19 U1.G15(PC7)
LCD_G7: LCD.20 U1.D11(PD3)
LCD_HS: LCD.32 U1.H15(PC6)
LCD_LEDA: C30.2 D1.2(K) LCD.2
LCD_LEDK: LCD.1 R15.1 U7.3(FB)
LCD_R0: LCD.5 U1.F4(PH2)
LCD_R1: LCD.6 U1.G4(PH3)
LCD_R2: LCD.7 U1.B14(PC10)
LCD_R3: LCD.8 U1.R5(PB0)
LCD_R4: LCD.9 U1.C15(PA11)
LCD_R5: LCD.10 U1.B15(PA12)
LCD_R6: LCD.11 U1.F15(PA8)
LCD_R7: LCD.12 U1.J15(PG6)
LCD_VS: LCD.33 U1.N4(PA4)
LED: R2.2 U1.N12(PH7)
MUTE: R31.2 U1.K15(PG3) U6.1(SDB)
NCAS: U1.B7(PG15) U2.K7(CAS#)
NE: U1.M4(PC2) U2.J8(CS#)
NRAS: U1.R6(PF11) U2.J9(RAS#)
NRST: R27.1 U1.J1(NRST)
NWE: U1.J4(PH5) U2.K8(WE#)
OSC_IN: C18.1 U1.G1(PH0) X1.1
OSC_OUT: C17.1 U1.H1(PH1) X1.3
PA1: H1.17 U1.N2(PA1)
PA2: H1.19 U1.P2(PA2)
PA3: H1.15 U1.R2(PA3)
PA7: H1.20 U1.R3(PA7)
PA10: H2.5 U1.D15(PA10)
PB1: H1.18 U1.R4(PB1)
PB2: H2.15 U1.M6(PB2)
PB4: H2.4 U1.A9(PB4)
PB12: H2.13 U1.P12(PB12)
PB13: H2.14 U1.P13(PB13)
PC0: H5.4 U1.M2(PC0)
PC1: H5.3 U1.M3(PC1)
PC4: H1.13 U1.N5(PC4)
PC5: H2.16 U1.P5(PC5)
PC13: H1.12 U1.D1(PC13)
PC14: H1.8 U1.E1(PC14)
PC15: H1.9 U1.F1(PC15)
PD5: H2.3 U1.C11(PD5)
PD11: H2.11 U1.N14(PD11)
PD12: H2.12 U1.N13(PD12)
PD13: H2.10 U1.M15(PD13)
PE0: H1.16 U1.A4(PE0)
PE1: H1.14 U1.A3(PE1)
PE2: H1.5 U1.A2(PE2)
PE3: H1.4 U1.A1(PE3)
PG9: H2.6 U1.C10(PG9)
PG13: H2.1 U1.A8(PG13)
PG14: H2.2 U1.A7(PG14)
PH6: H2.9 U1.M11(PH6)
PI8: H5.5 U1.D2(PI8)
PI11: H1.11 U1.E4(PI11)
SDIO_CLK: MICRO-SD.5(CLK) R19.1 U1.A12(PC12)
SDIO_CMD: MICRO-SD.3(CMD) R18.1 U1.D12(PD2)
SDIO_D0: MICRO-SD.7(DAT0) R20.1 U1.G14(PC8)
SDIO_D1: MICRO-SD.8(DAT1) R21.1 U1.F14(PC9)
SDIO_D2: MICRO-SD.1(DAT2) R16.1 U1.E15(PA9)
SDIO_D3: MICRO-SD.2(CD/DAT3) R17.1 U1.B13(PC11)
SDIO_DET: MICRO-SD.9(CARD_DET) R22.1 U1.D10(PD4)
SWCLK: H3.4 U1.A14(PA14)
SWDIO: H3.3 U1.A15(PA13)
UART_RX: U1.A10(PB3) U4.8(TXD)
UART_TX: U1.A13(PA15) U4.9(RXD)
USB_DN: U1.R14(PB14) USB_HS.5(DN2) USB_HS.7(DN1)
USB_DP: U1.R15(PB15) USB_HS.6(DP1) USB_HS.8(DP2)
VO+: H4.2 R32.1 U6.5(VO+)
VO-: H4.1 R32.2 U6.8(VO-)
$1N7803: C23.2 R7.1 R27.2 RST.4
$1N85964: R3.2 R33.1 USB_HS.4(CC1)
$1N89692: R5.2 USB_UART.4(CC1)
$1N89699: R6.2 USB_UART.10(CC2)
$1N91861: C24.2 KEY1.2 R8.1 R28.2
$1N92138: C25.2 KEY2.2 R9.1 R29.2
$1N96565: C35.2 R25.2 R26.1
$1N96800: C34.1 C36.2 R26.2
$1N98288: C34.2 R24.1
$1N98867: C33.2 R23.1
$1N99088: R24.2 U6.4(IN-)
$1N99180: R23.2 U6.3(IN+)
$1N101284: C38.1 U6.2(NC)
$1N117625: C26.2 KEY3.2 R10.1 R30.2
$1N125983: LED2.2(A) R2.1
$1N130357: D1.1(A) L1.2 U7.1(SW)
$1N145785: LED1.2(A) R1.1
$1N308099: R4.2 R34.1 USB_HS.10(CC2)

Not connected (* = marked no-connect by the designer): LCD 35 37 38 39 40; RST 1* 2* 3* 6*; U1 F13(NC)* L4(NC)* M10(NC)*; U2 E3(NC)* E7(NC)* H3(NC)* H7(NC)* K2(NC)* K3(NC)*; U4 4(RTS#)* 5(CTS#)* 6(TNOW)*; USB_HS 3(SBU2)* 9(SBU1)*; USB_UART 3(SBU2)* 9(SBU1)*
